# EAGLE design Muscle Display (EAGLE 9.5.0)
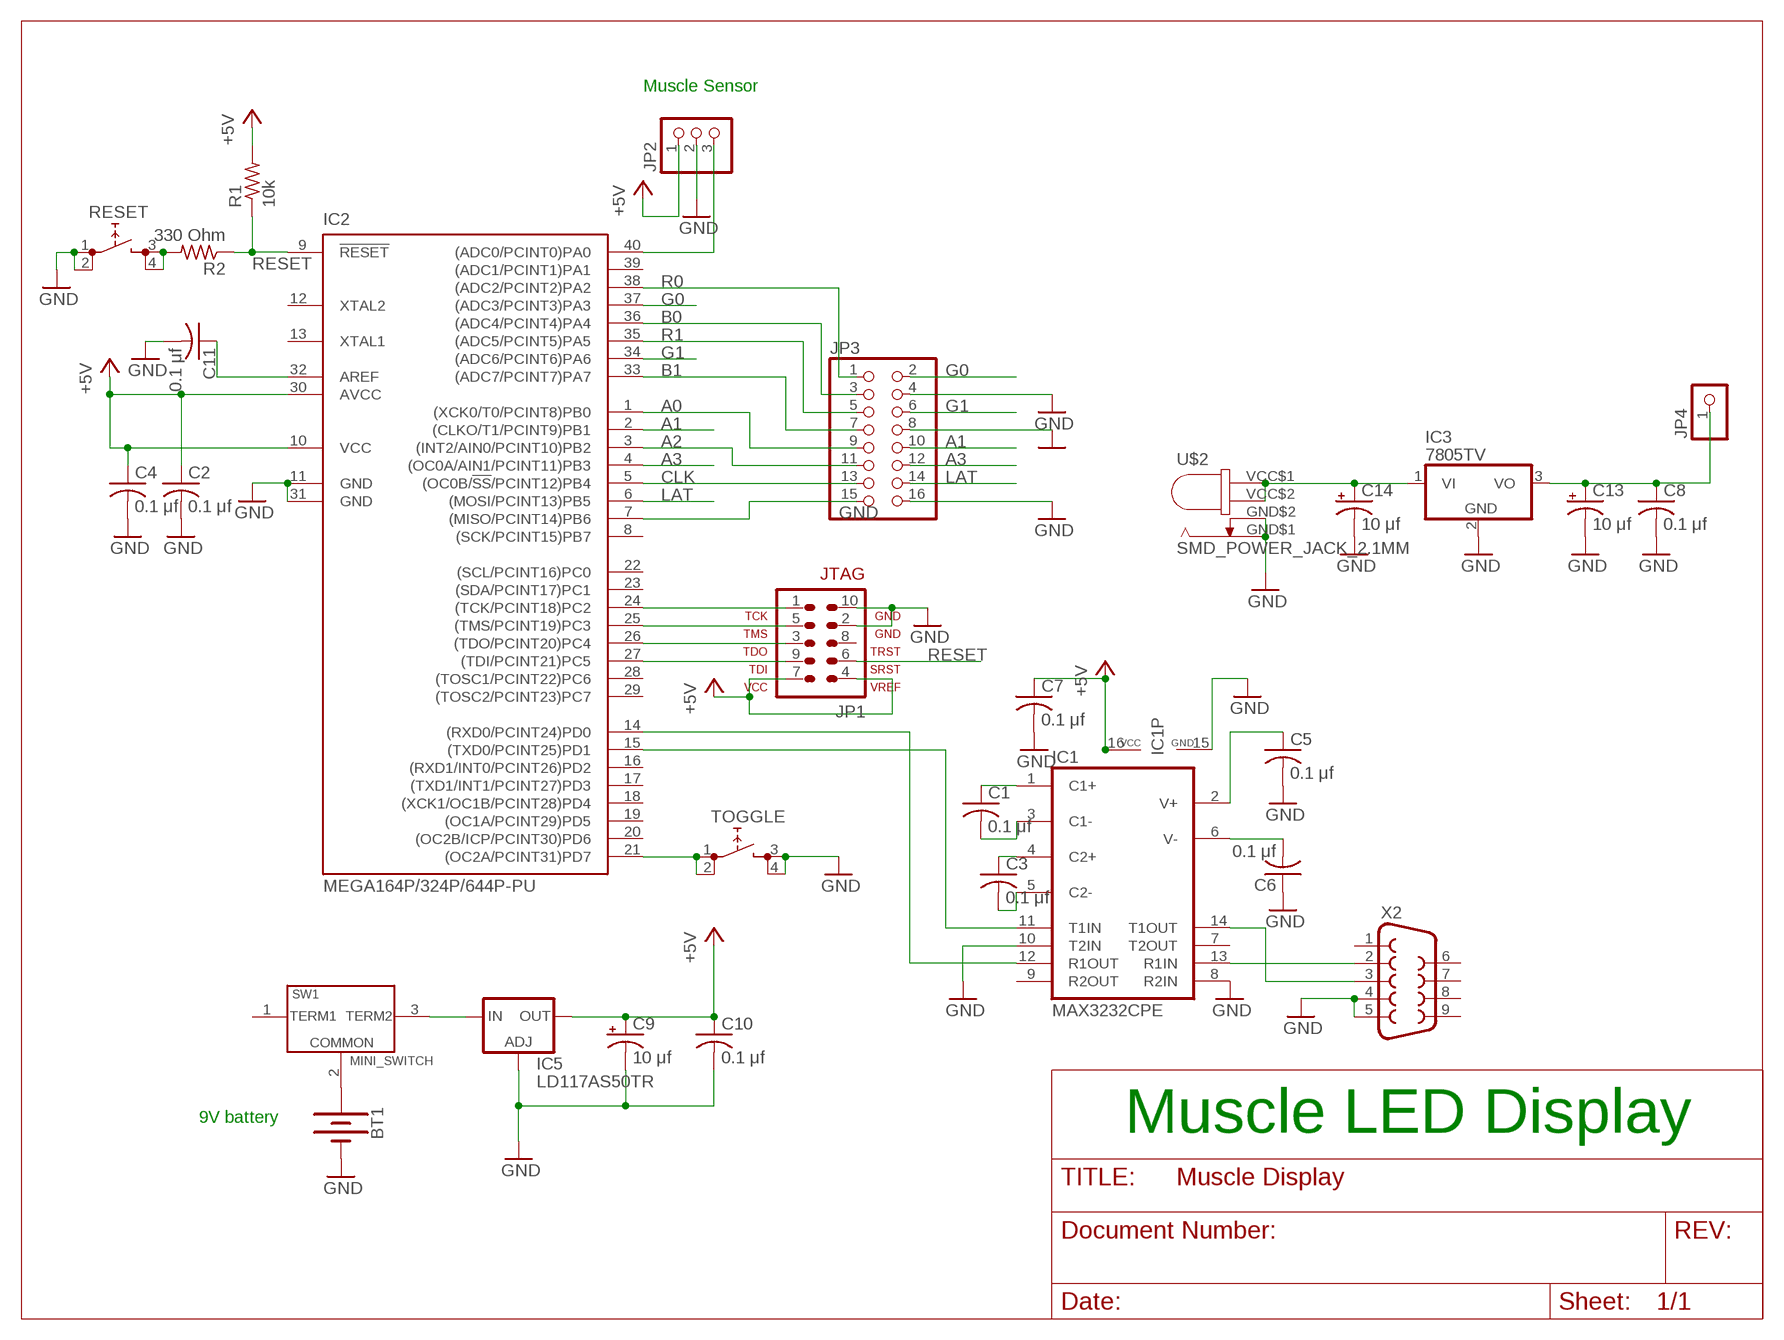
[diagram p0: schematic, sheet 1]

## Parts
BT1  BATTERY-9V  [BATTCON_9V]
C1  0.1 μf  C-USC050-025X075  [C050-025X075]
C2  0.1 μf  C-USC050-025X075  [C050-025X075]
C3  0.1 μf  C-USC050-025X075  [C050-025X075]
C4  0.1 μf  C-USC050-025X075  [C050-025X075]
C5  0.1 μf  C-USC050-025X075  [C050-025X075]
C6  0.1 μf  C-USC050-025X075  [C050-025X075]
C7  0.1 μf  C-USC050-025X075  [C050-025X075]
C8  0.1 μf  C-USC050-025X075  [C050-025X075]
C9  10 μf  CPOL-USC  [PANASONIC_C]
C10  0.1 μf  C-USC0805  [C0805]
C11  0.1 μf  C-USC050-025X075  [C050-025X075]
C13  10 μf  CPOL-USE2.5-5  [E2,5-5]
C14  10 μf  CPOL-USE2.5-5  [E2,5-5]
IC1  MAX3232CPE  [DIL16]
IC2  MEGA164P/324P/644P-PU  [DIL40]
IC3  7805TV  [TO220V]
IC5  LD117AS50TR  [SOT223]
JP1  AVR-JTAG-10  [AVR-JTAG-10]
JP2  PINHD-1X3  [1X03]
JP3  PINHD-2X8  [2X08]
JP4  PINHD-1X1  [1X01]
R1  10k  R-US_0207/10  [0207/10]
R2  330 Ohm  R-US_0207/10  [0207/10]
RESET  PUSHBUTTON  [TL1105SP]
SW1  MINI_SWITCH  [MINI_SWITCH]
TOGGLE  PUSHBUTTON  [TL1105SP]
U$2  SMD_POWER_JACK_2.1MM  [SMD_POWER-JACK_2.1MM]
X2  F09H  [F09H]

## Nets
+5V: C2.1 C4.1 C7.1 C9.+ C10.1 IC1.16(VCC) IC2.10(VCC) IC2.30(AVCC) IC5.4(OUT) JP1.4 JP1.7 JP2.1 R1.2
A0: IC2.1((XCK0/T0/PCINT8)PB0) JP3.9
A1: IC2.2((CLKO/T1/PCINT9)PB1) JP3.10
A2: IC2.3((INT2/AIN0/PCINT10)PB2) JP3.11
A3: IC2.4((OC0A/AIN1/PCINT11)PB3) JP3.12
B0: IC2.36((ADC4/PCINT4)PA4) JP3.3
B1: IC2.33((ADC7/PCINT7)PA7) JP3.7
CLK: IC2.5((OC0B/!SS!/PCINT12)PB4) JP3.13
G0: IC2.37((ADC3/PCINT3)PA3) JP3.2
G1: IC2.34((ADC6/PCINT6)PA6) JP3.6
GND: BT1.- C2.2 C4.2 C5.2 C6.1 C7.2 C8.2 C9.- C10.2 C11.2 C13.- C14.- IC1.8(R2IN) IC1.10(T2IN) IC1.15(GND) IC2.11(GND) IC2.31(GND) IC3.2(GND) IC5.1(ADJ) JP1.2 JP1.10 JP2.2 JP3.4 JP3.8 JP3.16 RESET.1 RESET.2 TOGGLE.3 TOGGLE.4 U$2.GND$1(OUTSIDE$1) U$2.GND$2(OUTSIDE$2) X2.4 X2.5
LAT: IC2.6((MOSI/PCINT13)PB5) JP3.14
N$1: C1.1 IC1.1(C1+)
N$2: C3.2 IC1.5(C2-)
N$3: C3.1 IC1.4(C2+)
N$4: IC1.13(R1IN) X2.2
N$6: BT1.+ SW1.2(COMMON)
N$7: IC5.3(IN) SW1.3(IO3)
N$8: R2.2 RESET.3 RESET.4
N$9: IC2.24((TCK/PCINT18)PC2) JP1.1
N$10: IC2.25((TMS/PCINT19)PC3) JP1.5
N$11: IC2.26((TDO/PCINT20)PC4) JP1.3
N$12: IC2.27((TDI/PCINT21)PC5) JP1.9
N$13: IC2.21((OC2A/PCINT31)PD7) TOGGLE.1 TOGGLE.2
N$15: IC1.14(T1OUT) X2.3
N$22: C1.2 IC1.3(C1-)
N$24: C8.1 C13.+ IC3.3(VO) JP4.1
N$26: C5.1 IC1.2(V+)
N$27: C6.2 IC1.6(V-)
N$28: C14.+ IC3.1(VI) U$2.VCC$1(INSIDE$1) U$2.VCC$2(INSIDE$2)
N$29: IC1.12(R1OUT) IC2.14((RXD0/PCINT24)PD0)
N$30: IC1.11(T1IN) IC2.15((TXD0/PCINT25)PD1)
N$33: C11.1 IC2.32(AREF)
OE: IC2.7((MISO/PCINT14)PB6) JP3.15
R0: IC2.38((ADC2/PCINT2)PA2) JP3.1
R1: IC2.35((ADC5/PCINT5)PA5) JP3.5
RESET: IC2.9(!RESET) JP1.6 R1.1 R2.1
SENSOR_INPUT: IC2.40((ADC0/PCINT0)PA0) JP2.3
Unconnected: IC1.7(T2OUT) IC1.9(R2OUT) IC2.8((SCK/PCINT15)PB7) IC2.12(XTAL2) IC2.13(XTAL1) IC2.16((RXD1/INT0/PCINT26)PD2) IC2.17((TXD1/INT1/PCINT27)PD3) IC2.18((XCK1/OC1B/PCINT28)PD4) IC2.19((OC1A/PCINT29)PD5) IC2.20((OC2B/ICP/PCINT30)PD6) IC2.22((SCL/PCINT16)PC0) IC2.23((SDA/PCINT17)PC1) IC2.28((TOSC1/PCINT22)PC6) IC2.29((TOSC2/PCINT23)PC7) IC2.39((ADC1/PCINT1)PA1) JP1.8 SW1.1(IO1) X2.1 X2.6 X2.7 X2.8 X2.9

## Notes on the sheet
- Muscle Sensor
- Muscle LED Display
- 9V battery

## Library data of the parts
BT1 = SparkFun-Batteries:BATTERY: Battery - Single Cell A variety of battery chemistries, sizes, and footprints. Device List: 20MM_PTH - Coin Cell Battery Holder - 20mm (PTH) <https://www.sparkfun.com/products/783> 20MM_PTH_KIT- Coin Cell battery Holder - 20 mm (PTH) <http://www.sparkfun.com/products/783>kit version with special mask 6.8MM_PTH - Coin Cell Battery Holder - 6.8MM(SMD) <https://www.digikey.com/product-detail/en/seiko-instruments/MS621FE-FL11E/728-1057-ND/1889208?WT.srch=1&gclid=CNOQ5a6LzdQCFZS2wAodXCkE0g> 12MM_SMD - Coin Cell Battery Holder - 12mm (SMD) <https://www.sparkfun.com/products/10592> 12MM_PTH - Coin Cell Battery Holder - 12mm (PTH) <https://www.sparkfun.com/products/7948> 20MM_SMD - 20mm Coin Cell Battery Holder (SMD) (2 legs) Used on the Big Time Watch Kit <https://www.sparkfun.com/products/11734> 20MM_SMD_4LEGS - Coin Cell Battery Holder - 20mm (SMD) <https://www.sparkfun.com/products/11892> 20MM_SMD_4LEGS_OVERPASTE - Coin Cell Battery Holder - 20mm (SMD) <https://www.sparkfun.com/products/11892> (Over-paste on the legs) 24.5MM_PTH - Coin Cell Battery Holder - 24.5mm (PTH) <https://www.sparkfun.com/products/8863> 9V - 9V Battery Holder - PC Mount Used on the SparkFun SparkPunk Sound Kit <https://www.sparkfun.com/products/11177> and SparkFun SparkPunk Sequencer Kit <https://www.sparkfun.com/products/12707> 18650 - Battery Holder - 18650 (PTH) <https://www.sparkfun.com/products/13113> AA - Battery Holder - 1xAA (PTH) <https://www.sparkfun.com/products/7949> AAA - Battery Holder - 1xAAA (PTH) <https://www.sparkfun.com/products/12718> AA_KIT - Battery Holder - 1xAA (PTH) <https://www.sparkfun.com/products/7949> Special kit package - pads only have exposed copper on one side of the board. AAA_KIT - Battery Holder - 1xAAA (PTH) <https://www.sparkfun.com/products/12718> Special kit package - pads only have exposed copper on one side of the board.; PROD_ID: BATT-10855
C1-C8 C11 = SouthernConn:C-US: CAPACITOR, American symbol
C9 C13 C14 = rcl:CPOL-US: POLARIZED CAPACITOR, American symbol
C10 = rcl:C-US: CAPACITOR, American symbol
IC1 = maxim:MAX3232*: True RS-232 Transceivers 3.0V to 5.5V, Low-Power up to 1Mbps, Using Four 0.1µF External Capacitors Source: http://pdfserv.maxim-ic.com/en/ds/MAX3222-MAX3241.pdf; MF: MAXIM; MPN: MAX3232CPE+; OC_FARNELL: 9724494; OC_NEWARK: 68K4626
IC2 = avr-7:MEGA164P/324P/644P-PU
IC3 = linear:78*: Positive VOLTAGE REGULATOR Source: http://cache.national.com/ds/LM/LM78L05.pdf http://www.fairchildsemi.com/ds/LM/LM7805.pdf
IC5 = v-reg:LD117A?*: Low drop fixed and adjustable positive voltage regulators 1 A Source: http://www.st.com/stonline/products/literature/ds/7194/ld1117axx.pdf
JP1 = avr-7:AVR-JTAG-10: AVR JTAG Debug/Programming Header
JP2 = pinhead:PINHD-1X3: PIN HEADER
JP3 = pinhead:PINHD-2X8: PIN HEADER
JP4 = pinhead:PINHD-1X1: PIN HEADER
R1 R2 = rcl:R-US_: RESISTOR, American symbol
RESET TOGGLE = SouthernConn:PUSHBUTTON: PUSHBUTTON SWITCH Tactile Switch
SW1 = tsh:MINI_SWITCH
U$2 = igm:SMD_POWER_JACK_2.1MM
X2 = con-subd:F09: SUB-D; OC_FARNELL: unknown; OC_NEWARK: unknown

## Module MUSCLE_SENSOR
Ports: 

### Library data of the parts

## Net classes
0 default: clearance 0.205 mm

## Board
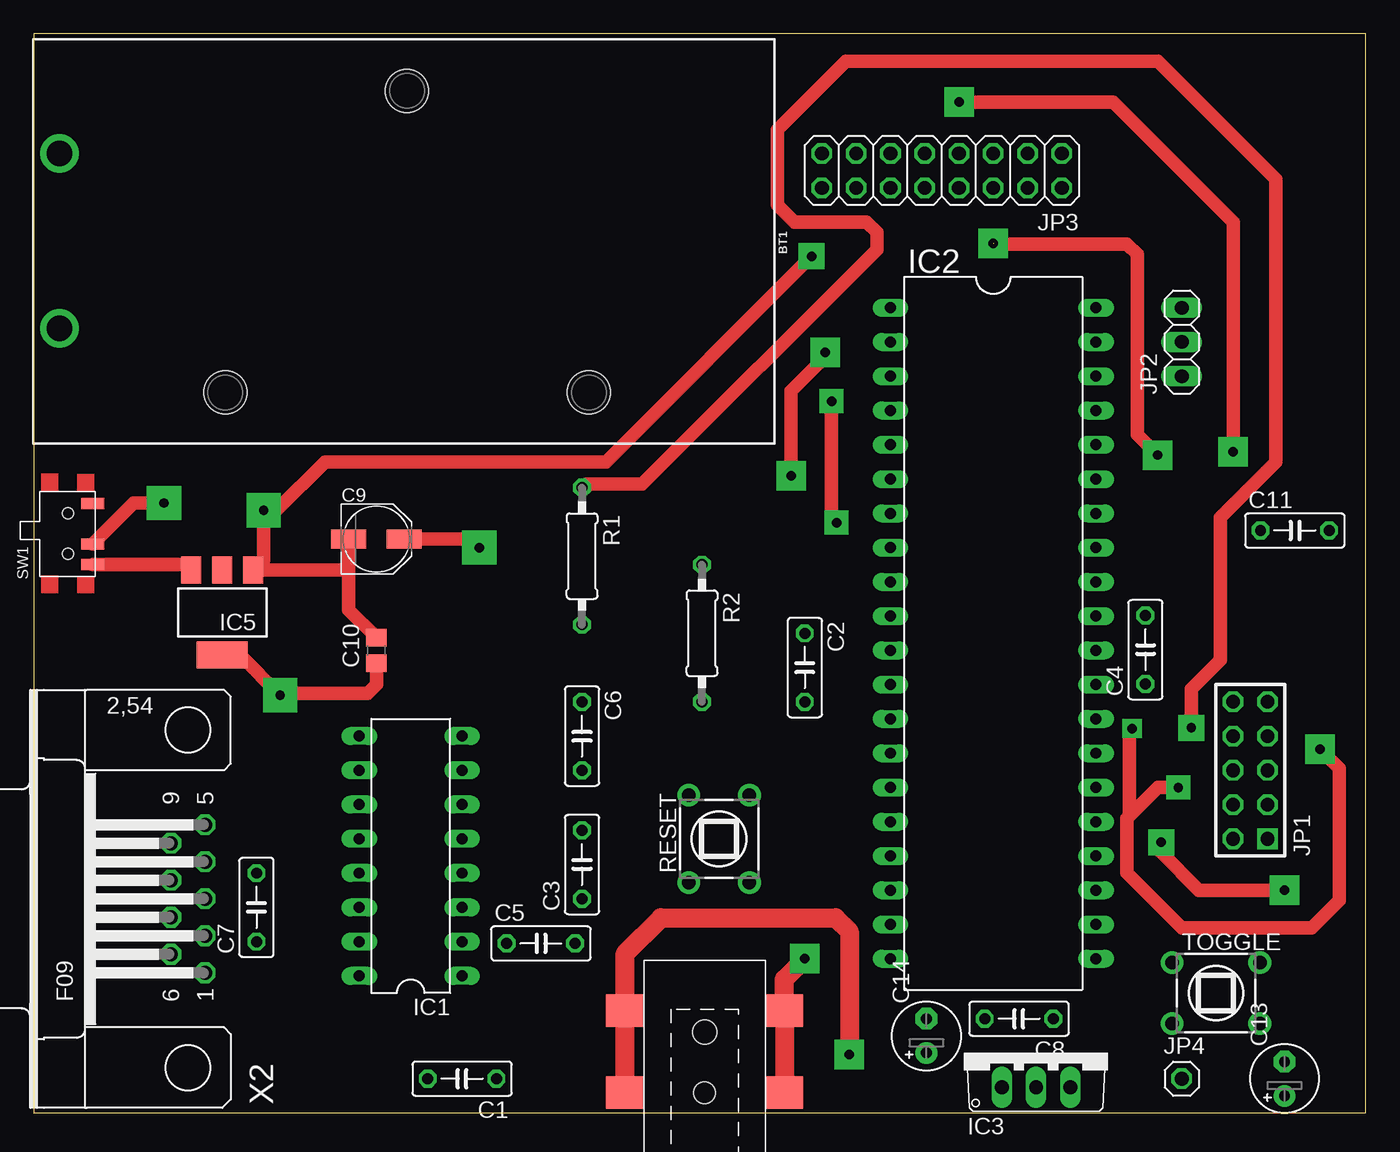
[diagram p1: board, top side]
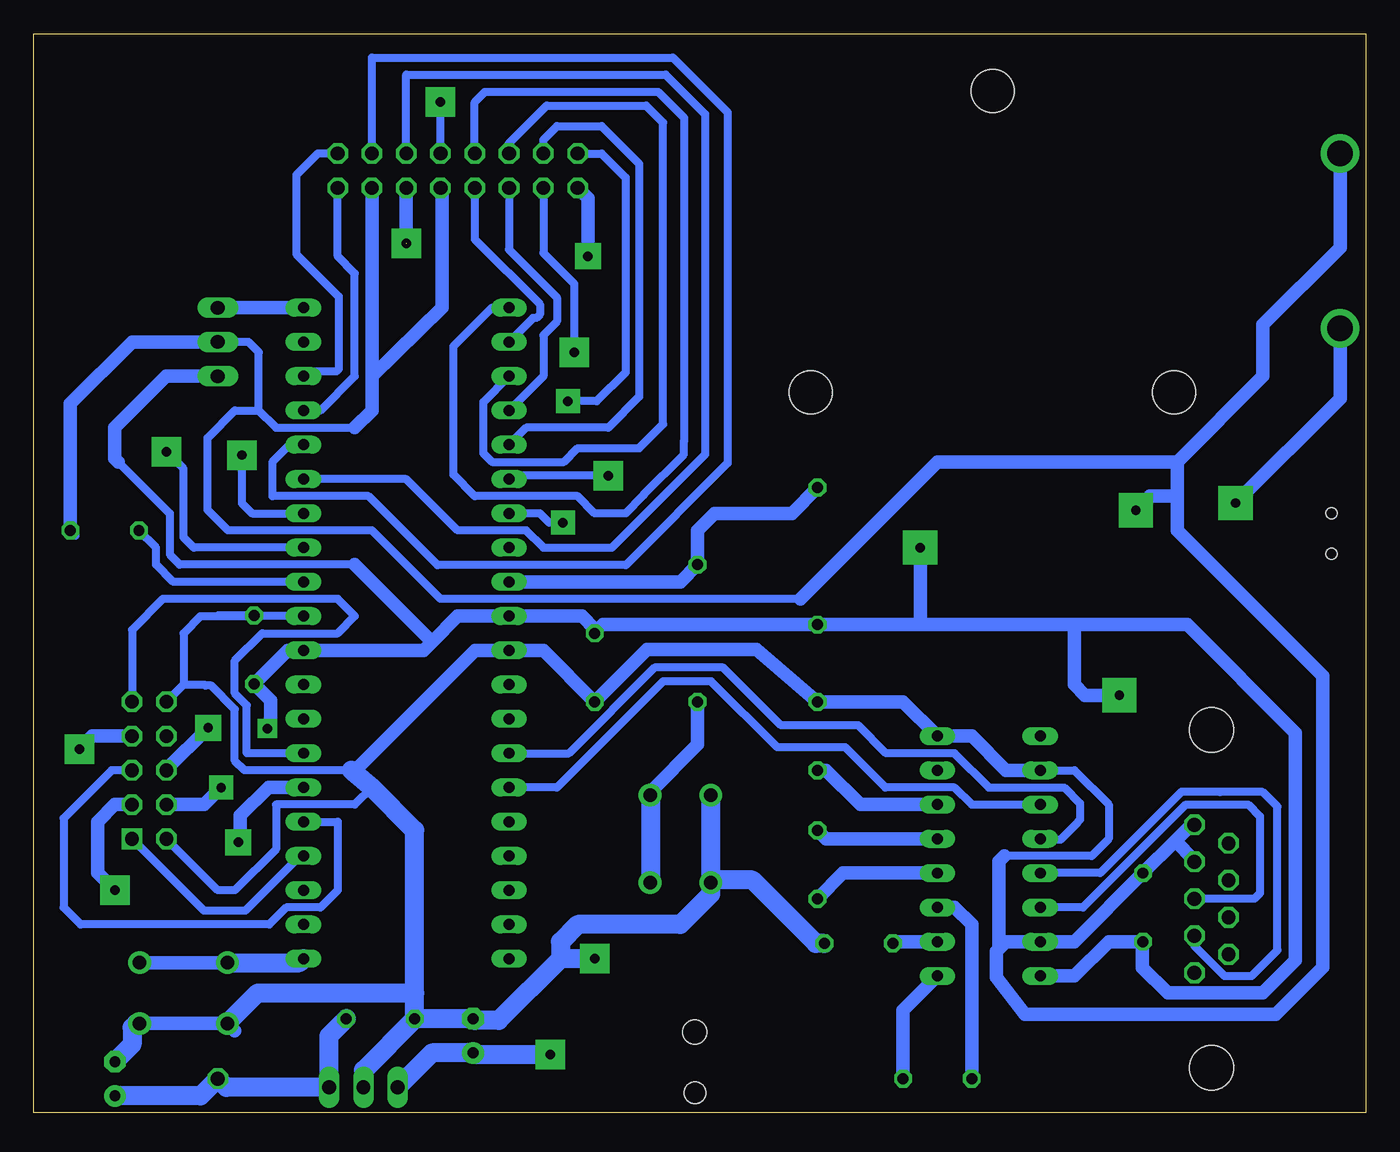
[diagram p2: board, bottom side, seen from below]

Size 98.73 x 80 mm. Coordinates in mm from the lower left corner, seen from the top.
Outline: 0,0 98.73,0 98.73,80 0,80 0,0
Copper layers (1*16): Top 0.035mm / dielectric 1.5mm / Bottom 0.035mm
Design rules "default *": minimum track width 24mil, minimum drill 24mil, track to track 8mil, track to pad 8mil, pad to pad 8mil, via to via 8mil, smd to smd 8mil, copper to edge 40mil, drill to drill 8mil, minimum pad ring 10mil, minimum via ring 8mil, stop-mask expansion 4mil, vias tented up to drill 0mil, thermal gap 10mil
Holes 3.2 mm at 14.2,53.43 41.15,53.42 27.66,75.74

### Footprints (pad centres in the part's own frame; a part is rotated, then mirrored left to right if it is on the bottom)
BATTCON_9V = drill 1.905: + 0,0; - 0,-12.954
C050-025X075 = drill 0.813 octagon: 1 -2.54,0; 2 2.54,0
PANASONIC_C = smd 2.6 x 1.4: + 2.05,0; - -2.05,0
C0805 = smd 1.3 x 1.5: 1 -0.95,0; 2 0.95,0
E2,5-5 = drill 0.813 pad 1.6: + -1.27,0 | drill 0.813 pad 1.6 octagon: - 1.27,0
DIL16 = drill 0.813 long: 1 -8.89,-3.81; 2 -6.35,-3.81; 3 -3.81,-3.81; 4 -1.27,-3.81; 5 1.27,-3.81; 6 3.81,-3.81; 7 6.35,-3.81; 8 8.89,-3.81; 9 8.89,3.81; 10 6.35,3.81; 11 3.81,3.81; 12 1.27,3.81; 13 -1.27,3.81; 14 -3.81,3.81; 15 -6.35,3.81; 16 -8.89,3.81
DIL40 = drill 0.813 long: 1 -24.13,-7.62; 2 -21.59,-7.62; 3 -19.05,-7.62; 4 -16.51,-7.62; 5 -13.97,-7.62; 6 -11.43,-7.62; 7 -8.89,-7.62; 8 -6.35,-7.62; 9 -3.81,-7.62; 10 -1.27,-7.62; 11 1.27,-7.62; 12 3.81,-7.62; 13 6.35,-7.62; 14 8.89,-7.62; 15 11.43,-7.62; 16 13.97,-7.62; 17 16.51,-7.62; 18 19.05,-7.62; 19 21.59,-7.62; 20 24.13,-7.62; 21 24.13,7.62; 22 21.59,7.62; 23 19.05,7.62; 24 16.51,7.62; 25 13.97,7.62; 26 11.43,7.62; 27 8.89,7.62; 28 6.35,7.62; 29 3.81,7.62; 30 1.27,7.62; 31 -1.27,7.62; 32 -3.81,7.62; 33 -6.35,7.62; 34 -8.89,7.62; 35 -11.43,7.62; 36 -13.97,7.62; 37 -16.51,7.62; 38 -19.05,7.62; 39 -21.59,7.62; 40 -24.13,7.62
TO220V = drill 1.016 long: 1 -2.54,-2.54; 2 0,-2.54; 3 2.54,-2.54
SOT223 = smd 1.5 x 2: 1 -2.3,-3.15; 2 0,-3.15; 3 2.3,-3.15 | smd 3.8 x 2: 4 0,3.15
AVR-JTAG-10 = drill 1.016 square: 1 -5.08,-1.27 | drill 1.016 octagon: 2 -5.08,1.27; 3 -2.54,-1.27; 4 -2.54,1.27; 5 0,-1.27; 6 0,1.27; 7 2.54,-1.27; 8 2.54,1.27; 9 5.08,-1.27; 10 5.08,1.27
1X03 = drill 1.016 long: 1 -2.54,0; 2 0,0; 3 2.54,0
2X08 = drill 1.016 octagon: 1 -8.89,-1.27; 2 -8.89,1.27; 3 -6.35,-1.27; 4 -6.35,1.27; 5 -3.81,-1.27; 6 -3.81,1.27; 7 -1.27,-1.27; 8 -1.27,1.27; 9 1.27,-1.27; 10 1.27,1.27; 11 3.81,-1.27; 12 3.81,1.27; 13 6.35,-1.27; 14 6.35,1.27; 15 8.89,-1.27; 16 8.89,1.27
1X01 = drill 1.016 octagon: 1 0,0
0207/10 = drill 0.813 octagon: 1 -5.08,0; 2 5.08,0
TL1105SP = drill 1 pad 1.676: 1 -2.25,-3.25; 2 -2.25,3.25; 3 2.25,-3.25; 4 2.25,3.25
MINI_SWITCH = smd 0.813 x 1.676: 1 -0.737,1.829; 2 2.261,1.829; 3 3.785,1.829 | hole 0.8: 0,0; 2.997,0
SMD_POWER-JACK_2.1MM = smd 2.8 x 2.4: GND$1 -1.4,9.8; GND$2 -1.4,3.7; VCC$1 10.4,9.8; VCC$2 10.4,3.7 | hole 1.6: 4.5,9.8 | hole 1.8: 4.5,5.3
F09H = drill 1.016 octagon: 1 -5.486,-1.27; 2 -2.743,-1.27; 3 0,-1.27; 4 2.743,-1.27; 5 5.486,-1.27; 6 -4.115,1.27; 7 -1.372,1.27; 8 1.372,1.27; 9 4.115,1.27 | hole 3.302: -12.522,0; 12.522,0

### Placement (x,y rotation side)
BT1  1.91,58.17 180 top
C1  31.75,2.54 180 top
C2  57.15,33.02 270 top
C3  40.64,18.41 90 top
C4  82.4,34.34 90 top
C5  37.59,12.57 0 top
C6  40.64,27.94 270 top
C7  16.51,15.24 90 top
C8  73.03,6.99 180 top
C9  25.4,42.55 0 top
C10  25.4,34.29 90 top
C11  93.47,43.18 0 top
C13  92.71,2.54 90 top
C14  66.17,5.71 90 top
IC1  27.94,19.05 90 top
IC2  71.12,35.56 270 top
IC3  74.3,4.45 0 top
IC5  13.97,37.08 180 top
JP1  90.17,25.4 90 top
JP2  85.09,57.15 90 top
JP3  67.31,69.85 180 top
JP4  85.09,2.54 0 top
R1  40.64,41.27 270 top
R2  49.53,35.56 270 top
RESET  50.8,20.32 0 top
SW1  2.54,44.45 270 top
TOGGLE  87.63,8.89 270 top
U$2  54.23,11.3 180 top
X2  11.43,15.88 90 top

### Tracks (layer width: path | path; a pad name or v marks a point on that pad's centre or on a via)
+5V  (via drill 0.7 pad 1.42, 0.7 pad 1.78, 0.7 pad 2.18, 0.7 pad 2.54)
  Top 0.61: 18.24,30.99 v18.26,30.96
  Top 1.016: v84.84,24.13 83.31,24.13 81.2,22.02 | 81.2,22.02 81.03,21.84 81.03,17.78 85.09,13.72 94.72,13.72 96.77,15.77 96.77,25.55 v95.35,26.98 | C9.+ 32.38,42.55 v33.02,41.91 | C10.1 25.4,31.75 24.77,31.11 18.41,31.11 v18.26,30.96 15.29,33.93 IC5.4 | 81.2,22.02 81.2,28.3 v81.41,28.5
  Bottom 0.61: IC1.16 22.86,10.16 | C2.1 56.52,36.2 | 74.93,40.64 87.95,40.64 87.95,40.7 88.65,41.4 88.65,44.45 92.46,48.26 | 95.25,27.08 v95.35,26.98 | 16.56,12.65 C7.1 | C4.1 82.4,31.47 | 81.18,28.55 v81.41,28.5
  Bottom 1.016: 56.52,36.2 R1.2 33.02,36.2 | C2.1 57.15,35.88 58.1,36.83 IC2.10 67.31,36.83 69.22,34.92 | v33.02,41.91 33.02,36.2 | JP2.1 88.9,54.61 92.71,50.8 92.71,48.51 92.46,48.26 | JP1.4 86.11,22.86 v84.84,24.13 | 69.22,34.92 69.85,34.29 IC2.30 79.91,34.29 C4.1 81.18,30.58 81.18,28.55 | 74.93,40.64 69.22,34.92 | C7.1 19.05,12.7 21.59,10.16 IC1.16 | 21.59,36.2 13.23,36.2 5.21,28.17 5.21,11.3 7.62,8.89 14.68,8.89 16.56,10.77 16.56,12.65 | 21.59,36.2 33.02,36.2 | v18.26,30.96 20.8,30.96 21.59,31.75 21.59,36.2 | JP1.7 94.39,27.94 v95.35,26.98
A0
  Bottom 0.61: JP3.9 66.04,74.93 65.28,75.69 52.45,75.69 50.52,73.76 50.52,49.81 50.55,49.78 50.55,48.82 53.52,45.85 53.52,45.8 54.86,44.45 57.15,44.45 58.42,45.72 66.04,45.72 67.63,47.31 67.63,56.83 64.77,59.69 IC2.1
A1
  Bottom 0.61: JP3.10 66.04,64.77 61.21,59.94 61.21,59.18 61.47,58.93 61.72,58.93 IC2.2
A2
  Bottom 0.61: IC2.3 65.41,52.7 65.41,48.9 64.77,48.26 59.44,48.26 58.42,49.28 53.85,49.28 52.07,51.05 52.07,73.41 53.34,74.68 60.71,74.68 63.5,71.88 JP3.11
A3
  Bottom 0.61: JP3.12 63.5,64.01 59.94,60.45 59.94,58.67 60.96,57.66 60.96,54.61 IC2.4
B0
  Bottom 0.61: JP3.3 73.66,78.23 51.36,78.23 47.3,74.17 47.3,48.16 54.84,40.62 68.81,40.62 73.91,45.72 81.03,45.72 81.03,47.24 81.05,47.27 81.05,48.23 79.76,49.53 IC2.36
B1  (via drill 0.7 pad 2.18)
  Top 1.016: v88.9,49.02 88.9,66.04 80.01,74.93 v68.58,74.93
  Bottom 0.61: JP3.7 v68.58,74.93 | IC2.33 86.87,41.91 87.63,42.67 87.63,47.75 v88.9,49.02
CLK
  Bottom 0.61: JP3.13 60.96,72.14 59.94,73.15 56.64,73.15 53.85,70.36 53.85,53.09 56.13,50.8 62.23,50.8 IC2.5
G0
  Bottom 0.61: IC2.37 77.47,52.07 74.93,54.61 74.93,62.23 76.2,63.5 JP3.2
G1  (via drill 0.7 pad 2.18)  (1 unrouted)
  Top 0.61: 71.17,64.41 v71.12,64.47
  Top 1.016: v83.31,48.77 81.79,50.29 81.79,63.65 81.03,64.41 71.17,64.41
  Bottom 0.61: v83.31,48.77 83.31,45.21 82.55,44.45 IC2.34
  Bottom 1.016: JP3.6 71.14,64.44
GND  (via drill 0.7 pad 1.93, 0.7 pad 2.18, 0.7 pad 2.54)
  Top 0.61: 16.26,40.25 IC5.1 | 22.94,40.23 23.35,40.64
  Top 1.016: C9.- 23.35,40.64 23.35,37.29 C10.2 | 22.94,40.23 IC5.1 17.04,41.01 v17.04,44.68 18.01,44.68 21.59,48.26 42.42,48.26 v57.66,63.5
  Top 1.422: U$2.GND$1 U$2.GND$2 55.63,9.91 v57.15,11.43
  Bottom 0.61: RESET.2 48.58,23.5 48.58,17.14 RESET.1 48.35,17.27 | 73.66,24.13 74.93,22.86 80.77,22.86 80.77,19.56 83.82,16.51 85.09,16.51 JP1.2 | 74.93,50.8 80.77,50.8 82.04,52.07 | 84.45,56.83 85.09,56.83 JP2.2 82.8,57.15 82.04,56.39 82.04,52.07 | 90.81,6.64 TOGGLE.4 | 91.15,6.64 91.44,6.35 | 66.04,6.86 C14.- | 68.48,68.58 JP3.8 | 41.91,38.1 68.58,38.1 73.66,43.18 84.33,43.18 85.85,44.7 85.85,50.04 83.82,52.07 82.04,52.07 | 87.63,31.75 87.63,35.56 86.36,36.83 85.09,36.83 | 95.63,42.8 C11.2 | IC1.10 21.59,25.4 19.05,22.86 19.05,20.32 20.32,19.05 26.8,19.05 | 85.09,36.83 82.45,36.83 C4.2 | C4.2 78.79,36.88 IC2.31 | C4.2 85.04,36.88 85.09,36.83 | 75.18,25.4 83.11,25.4 83.82,26.11 83.82,29.92 85.57,31.67 86,31.67 86.08,31.75 87.63,31.75 | 87.63,31.75 JP1.10
  Bottom 1.016: 14.13,20.16 12.7,21.59 X2.5 | 14.13,20.16 C7.2 21.59,12.7 IC1.15 26.67,12.7 27.2,12.17 | 14.13,20.16 12.7,18.73 X2.4 | 73.66,54.61 JP3.4 | TOGGLE.4 90.81,6.35 90.81,6.64 TOGGLE.3 83.82,6.08 | 73.66,54.61 68.48,59.69 68.48,68.58 | C11.2 96.01,52.58 91.44,57.15 JP2.2 | BT1.- 1.91,64.14 7.62,58.42 7.62,54.61 13.97,48.26 | v57.66,63.5 57.66,67.82 JP3.16 | 13.97,48.26 13.97,45.72 | 41.91,38.1 31.75,48.26 13.97,48.26 | 13.97,45.72 16,45.72 v17.04,44.68 | 73.66,54.61 73.66,52.07 74.93,50.8 | 27.2,12.17 27.38,11.99 27.38,10.06 25.26,7.3 6.67,7.3 3.17,10.79 3.17,32.38 13.97,43.18 13.97,45.72 | IC1.10 26.67,25.4 29.21,27.94 IC1.8 34.29,30.48 C6.1 45.16,34.37 53.26,34.37 C2.2 60.96,34.29 IC2.11 66.02,34.29 75.03,25.27 | 26.8,19.05 27.2,18.64 27.2,12.17
  Bottom 1.422: C14.- C8.2 | IC3.2 74.3,3.17 C8.2 | TOGGLE.3 82.13,8.89 70.48,8.89 | TOGGLE.4 91.15,6.64 | 91.44,6.35 91.44,5.08 C13.- | C5.2 40.77,12.57 45.47,17.27 48.35,17.27 | v57.15,11.43 59.69,11.43 | 59.69,11.43 64.26,6.86 66.04,6.86 | RESET.2 48.55,16.22 50.8,13.97 58.42,13.97 59.69,12.7 59.69,11.43 | 75.18,25.4 75.03,25.27 73.66,24.13 70.48,20.95 70.48,8.89 | C8.2 70.48,8.89
LAT  (via drill 0.7 pad 2.18)
  Top 0.61: v58.67,56.39 58.67,56.06
  Top 1.016: v56.13,47.24 56.13,53.52 58.67,56.06
  Bottom 0.61: v56.13,47.24 63.25,47.24 IC2.6 | JP3.14 60.96,63.75 58.67,61.47 v58.67,56.39
N$1
  Bottom 1.016: C1.1 34.29,7.62 IC1.1
N$2
  Bottom 1.016: IC1.5 40.01,20.32 C3.2
N$3
  Bottom 1.016: IC1.4 38.73,17.78 C3.1
N$4
  Bottom 0.61: IC1.13 19.68,17.78 13.65,23.81 10.79,23.81 10.78,23.8 7.64,23.8 6.55,22.71 6.55,12.06 8.46,10.16 10.48,10.16 12.7,12.38 X2.2
N$6  (via drill 0.7 pad 2.54)
  Top 1.016: v9.65,45.21 7.39,45.21 SW1.2
  Bottom 1.016: BT1.+ 1.91,52.96 v9.65,45.21
N$7
  Top 1.016: SW1.3 11.24,40.66 IC5.3
N$8
  Bottom 0.61: 53.02,23.81 RESET.4 | 53.02,17.14 RESET.3
  Bottom 1.016: R2.2 49.53,27.3 53.02,23.81 | 53.02,23.5 RESET.4
  Bottom 1.422: 53.02,23.5 53.02,17.14
N$9
  Bottom 0.61: IC2.24 78.99,19.05 83.06,14.99 86.11,14.99 JP1.1
N$10
  Bottom 0.61: IC2.25 76.2,21.59 76.2,16.51 77.47,15.24 80.01,15.24 81.28,13.97 95.25,13.97 96.52,15.24 96.52,21.84 92.96,25.4 JP1.5
N$11  (via drill 0.7 pad 1.93, 0.7 pad 2.18)
  Top 0.61: v83.57,20.07 83.57,19.3
  Top 1.016: 83.57,19.3 86.36,16.51 v92.71,16.51
  Bottom 0.61: 83.41,20.22 v83.57,20.07
  Bottom 1.016: IC2.26 81.33,24.13 83.41,22.05 83.41,20.22 | JP1.3 92.71,22.86 93.98,21.59 93.98,17.78 v92.71,16.51
N$12
  Bottom 0.61: JP1.9 91.44,35.81 89.15,38.1 76.2,38.1 74.93,36.83 76.2,35.56 81.79,35.56 83.82,33.53 83.82,31.11 82.93,30.23 82.93,26.67 IC2.27
N$13
  Bottom 1.016: TOGGLE.1 TOGGLE.2
  Bottom 1.422: TOGGLE.1 79.03,11.14 IC2.21
N$15
  Bottom 0.61: IC1.14 20.95,15.24 13.34,22.86 8.71,22.86 7.85,22 7.85,16.28 8.26,15.88 X2.3
N$22
  Bottom 1.016: C1.2 29.21,13.97 30.48,15.24 IC1.3
N$24
  Bottom 1.422: C13.+ 86.36,1.27 JP4.1 84.45,1.91 IC3.3 76.83,5.71 C8.1
N$26
  Bottom 1.016: IC1.2 34.92,12.7 C5.1
N$27
  Bottom 1.016: IC1.6 37.47,22.86 40.01,25.4 C6.2
N$28  (via drill 0.7 pad 2.18)
  Top 0.61: U$2.VCC$2 U$2.VCC$1
  Top 1.422: U$2.VCC$1 43.83,11.82 46.48,14.48 59.44,14.48 60.45,13.46 v60.45,4.32
  Bottom 0.61: 66.04,4.32 C14.+
  Bottom 1.422: C14.+ 69.22,4.45 IC3.1 | v60.45,4.32 66.04,4.32
N$29
  Bottom 0.61: IC2.14 59.05,26.67 52.7,33.02 47.62,33.02 43.33,28.73 37.62,28.73 35.56,26.67 30.48,26.67 27.94,24.13 22.35,24.13 21.18,22.96 21.18,21.74 21.36,21.57 21.36,21.51 22.63,20.24 24.05,20.24 IC1.12
N$30
  Bottom 0.61: IC1.11 29.21,22.86 30.48,24.13 35.61,24.13 38.58,27.1 43.61,27.1 48.51,32 52.07,32 59.94,24.13 IC2.15
N$33
  Bottom 0.61: C11.1 89.66,41.91 89.66,40.64 88.39,39.37 IC2.32
OE  (via drill 0.7 pad 1.78)
  Top 1.016: v59.13,52.76 59.13,44.15 v59.51,43.76
  Bottom 0.61: JP3.15 56.64,71.12 54.86,69.34 54.86,54.89 57,52.76 v59.13,52.76 | IC2.7 61.21,44.45 60.53,43.76 v59.51,43.76
R0
  Bottom 0.61: JP3.1 77.67,71.12 79.27,69.52 79.27,63.68 76.12,60.53 76.12,55.14 76.3,54.97 78.38,54.97 IC2.38
R1
  Bottom 0.61: JP3.5 71.12,76.96 51.89,76.96 48.97,74.04 48.97,48.82 55.88,41.91 60.96,41.91 62.23,43.18 67.31,43.18 71.12,46.99 IC2.35
RESET  (via drill 0.7 pad 1.93)
  Top 1.016: R1.1 41.02,46.61 45.09,46.61 62.48,64.01 62.48,65.28 61.72,66.04 56.39,66.04 55.12,67.31 55.12,72.9 60.2,77.98 83.31,77.98 92.08,69.22 92.08,48.26 87.96,44.15 87.96,33.58 85.8,31.42 v85.8,28.55
  Bottom 1.016: R1.1 42.55,44.45 48.26,44.45 49.53,43.18 R2.1 50.8,39.37 IC2.9 | JP1.6 88.9,25.45 v85.8,28.55
SENSOR_INPUT
  Bottom 1.016: JP2.3 IC2.40